# EAGLE design untitled (EAGLE 9.6.2)
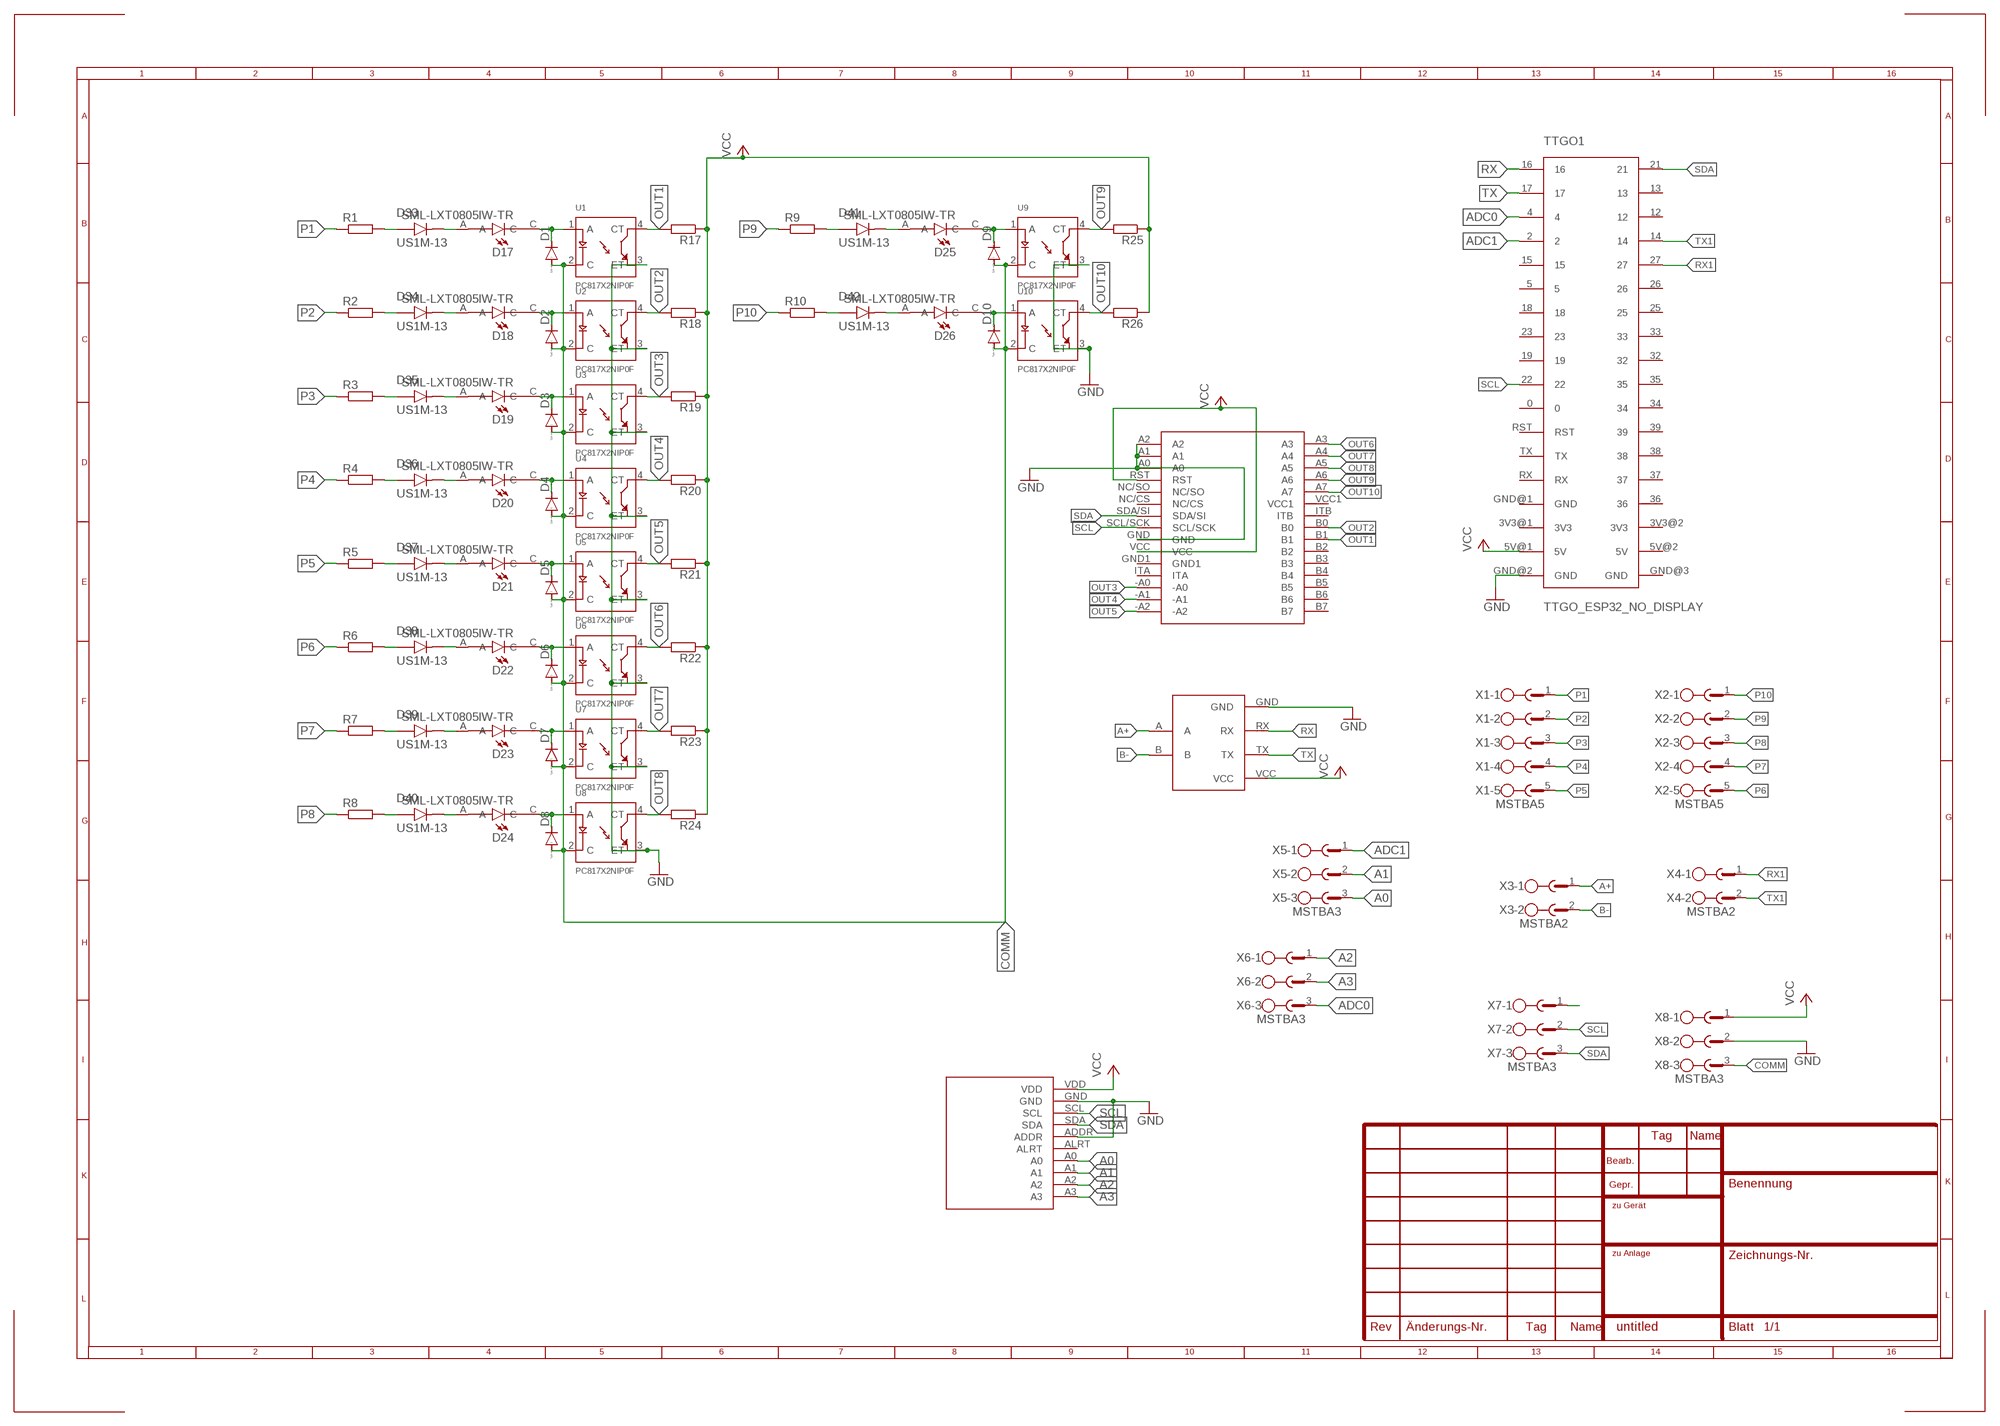
[diagram p0: schematic, sheet 1]

## Parts
ADS1  ADS1115  [ADS1115]
D1  DIODE-SOD123  [SOD123]
D2  DIODE-SOD123  [SOD123]
D3  DIODE-SOD123  [SOD123]
D4  DIODE-SOD123  [SOD123]
D5  DIODE-SOD123  [SOD123]
D6  DIODE-SOD123  [SOD123]
D7  DIODE-SOD123  [SOD123]
D8  DIODE-SOD123  [SOD123]
D9  DIODE-SOD123  [SOD123]
D10  DIODE-SOD123  [SOD123]
D17  SML-LXT0805IW-TR  [LEDC2012X120N]
D18  SML-LXT0805IW-TR  [LEDC2012X120N]
D19  SML-LXT0805IW-TR  [LEDC2012X120N]
D20  SML-LXT0805IW-TR  [LEDC2012X120N]
D21  SML-LXT0805IW-TR  [LEDC2012X120N]
D22  SML-LXT0805IW-TR  [LEDC2012X120N]
D23  SML-LXT0805IW-TR  [LEDC2012X120N]
D24  SML-LXT0805IW-TR  [LEDC2012X120N]
D25  SML-LXT0805IW-TR  [LEDC2012X120N]
D26  SML-LXT0805IW-TR  [LEDC2012X120N]
D33  US1M-13  [DIOM5226X240N]
D34  US1M-13  [DIOM5226X240N]
D35  US1M-13  [DIOM5226X240N]
D36  US1M-13  [DIOM5226X240N]
D37  US1M-13  [DIOM5226X240N]
D38  US1M-13  [DIOM5226X240N]
D39  US1M-13  [DIOM5226X240N]
D40  US1M-13  [DIOM5226X240N]
D41  US1M-13  [DIOM5226X240N]
D42  US1M-13  [DIOM5226X240N]
MCP1  MCP23017  [MCP23017]
R1  R-EU_0414/15  [0414/15]
R2  R-EU_0414/15  [0414/15]
R3  R-EU_0414/15  [0414/15]
R4  R-EU_0414/15  [0414/15]
R5  R-EU_0414/15  [0414/15]
R6  R-EU_0414/15  [0414/15]
R7  R-EU_0414/15  [0414/15]
R8  R-EU_0414/15  [0414/15]
R9  R-EU_0414/15  [0414/15]
R10  R-EU_0414/15  [0414/15]
R17  R-EU_R0805  [R0805]
R18  R-EU_R0805  [R0805]
R19  R-EU_R0805  [R0805]
R20  R-EU_R0805  [R0805]
R21  R-EU_R0805  [R0805]
R22  R-EU_R0805  [R0805]
R23  R-EU_R0805  [R0805]
R24  R-EU_R0805  [R0805]
R25  R-EU_R0805  [R0805]
R26  R-EU_R0805  [R0805]
TTGO1  TTGO_ESP32_NO_DISPLAY  [TTGO_ESP32_NO_DISPLAY]
TTL-RS1  TTL-RS485  [TTL-RS485]
U1  PC817X2NIP0F  [SOT254P975X400-4N]
U2  PC817X2NIP0F  [SOT254P975X400-4N]
U3  PC817X2NIP0F  [SOT254P975X400-4N]
U4  PC817X2NIP0F  [SOT254P975X400-4N]
U5  PC817X2NIP0F  [SOT254P975X400-4N]
U6  PC817X2NIP0F  [SOT254P975X400-4N]
U7  PC817X2NIP0F  [SOT254P975X400-4N]
U8  PC817X2NIP0F  [SOT254P975X400-4N]
U9  PC817X2NIP0F  [SOT254P975X400-4N]
U10  PC817X2NIP0F  [SOT254P975X400-4N]
X1  MSTBA5  [MSTBA5]
X2  MSTBA5  [MSTBA5]
X3  MSTBA2  [MSTBA2]
X4  MSTBA2  [MSTBA2]
X5  MSTBA3  [MSTBA3]
X6  MSTBA3  [MSTBA3]
X7  MSTBA3  [MSTBA3]
X8  MSTBA3  [MSTBA3]

## Nets
A0: ADS1.A0 X5.3
A1: ADS1.A1 X5.2
A2: ADS1.A2 X6.1
A3: ADS1.A3 X6.2
A+: TTL-RS1.A X3.1
ADC0: TTGO1.4 X6.3
ADC1: TTGO1.2 X5.1
B-: TTL-RS1.B X3.2
COMM: D1.A D2.A D3.A D4.A D5.A D6.A D7.A D8.A D9.A D10.A U1.2(C) U2.2(C) U3.2(C) U4.2(C) U5.2(C) U6.2(C) U7.2(C) U8.2(C) U9.2(C) U10.2(C) X8.3
GND: ADS1.ADDR ADS1.GND MCP1.A0 MCP1.A1 MCP1.A2 MCP1.GND TTGO1.GND@2(GND) TTL-RS1.GND U1.3(ET) U2.3(ET) U3.3(ET) U4.3(ET) U5.3(ET) U6.3(ET) U7.3(ET) U8.3(ET) U9.3(ET) U10.3(ET) X8.2
N$1: D17.A D33.C(K)
N$2: D33.A R1.2
N$3: D1.C D17.C U1.1(A)
N$5: D34.A R2.2
N$6: D18.A D34.C(K)
N$7: D2.C D18.C U2.1(A)
N$8: D35.A R3.2
N$9: D19.A D35.C(K)
N$10: D3.C D19.C U3.1(A)
N$11: D36.A R4.2
N$12: D20.A D36.C(K)
N$13: D4.C D20.C U4.1(A)
N$15: X7.1
N$17: D37.A R5.2
N$18: D21.A D37.C(K)
N$19: D5.C D21.C U5.1(A)
N$20: D38.A R6.2
N$21: D22.A D38.C(K)
N$22: D6.C D22.C U6.1(A)
N$25: D39.A R7.2
N$26: D23.A D39.C(K)
N$27: D7.C D23.C U7.1(A)
N$28: D40.A R8.2
N$29: D24.A D40.C(K)
N$30: D8.C D24.C U8.1(A)
N$33: D41.A R9.2
N$34: D25.A D41.C(K)
N$35: D9.C D25.C U9.1(A)
N$36: D42.A R10.2
N$37: D26.A D42.C(K)
N$38: D10.C D26.C U10.1(A)
OUT1: MCP1.B1 R17.2 U1.4(CT)
OUT2: MCP1.B0 R18.2 U2.4(CT)
OUT3: MCP1.-A0 R19.2 U3.4(CT)
OUT4: MCP1.-A1 R20.2 U4.4(CT)
OUT5: MCP1.-A2 R21.2 U5.4(CT)
OUT6: MCP1.A3 R22.2 U6.4(CT)
OUT7: MCP1.A4 R23.2 U7.4(CT)
OUT8: MCP1.A5 R24.2 U8.4(CT)
OUT9: MCP1.A6 R25.2 U9.4(CT)
OUT10: MCP1.A7 R26.2 U10.4(CT)
P1: R1.1 X1.1
P2: R2.1 X1.2
P3: R3.1 X1.3
P4: R4.1 X1.4
P5: R5.1 X1.5
P6: R6.1 X2.5
P7: R7.1 X2.4
P8: R8.1 X2.3
P9: R9.1 X2.2
P10: R10.1 X2.1
RX: TTGO1.16 TTL-RS1.RX
RX1: TTGO1.27 X4.1
SCL: ADS1.SCL MCP1.SCL/SCK TTGO1.22 X7.2
SDA: ADS1.SDA MCP1.SDA/SI TTGO1.21 X7.3
TX: TTGO1.17 TTL-RS1.TX
TX1: TTGO1.14 X4.2
VCC: ADS1.VDD MCP1.RST MCP1.VCC R17.1 R18.1 R19.1 R20.1 R21.1 R22.1 R23.1 R24.1 R25.1 R26.1 TTGO1.5V@1(5V) TTL-RS1.VCC X8.1
Unconnected: ADS1.ALRT MCP1.B2 MCP1.B3 MCP1.B4 MCP1.B5 MCP1.B6 MCP1.B7 MCP1.GND1 MCP1.ITA MCP1.ITB MCP1.NC/CS MCP1.NC/SO MCP1.VCC1 TTGO1.0 TTGO1.3V3@1(3V3) TTGO1.3V3@2(3V3) TTGO1.5 TTGO1.5V@2(5V) TTGO1.12 TTGO1.13 TTGO1.15 TTGO1.18 TTGO1.19 TTGO1.23 TTGO1.25 TTGO1.26 TTGO1.32 TTGO1.33 TTGO1.34 TTGO1.35 TTGO1.36 TTGO1.37 TTGO1.38 TTGO1.39 TTGO1.GND@1(GND) TTGO1.GND@3(GND) TTGO1.RST TTGO1.RX TTGO1.TX

## Library data of the parts
ADS1 = ds1115:ADS1115
D1-D10 = diode:DIODE-: DIODE
D17-D26 = SML-LXT0805IW-TR:SML-LXT0805IW-TR: LED; Luminous Intensity:11µcd; Viewing Angle:140°; Forward Current:30mA; Forward Voltage:2V; Color:Red; LED Color:Red; Leaded Process Compatible:Yes; Lens Color:White; Mounting Type:Surface Mount ;RoHS Compliant: Yes Check availability <https://pricing.snapeda.com/parts/SML-LXT0805IW-TR/Lumex%20Opto/Components/view-part?ref=eda>; AVAILABILITY: In Stock; DESCRIPTION: Red - LED Indication - Discrete 2V 0805 (2012 Metric); MF: Lumex Opto/Components; MP: SML-LXT0805IW-TR; PACKAGE: 0805 Lumex; PRICE: None; PURCHASE-URL: https://pricing.snapeda.com/search/part/SML-LXT0805IW-TR/?ref=eda
D33-D42 = US1M-13:US1M-13: Diode, Fast Recovery, 1a, 1kv, Do-214ac-2, Full Reel Check availability <https://pricing.snapeda.com/parts/US1M-13/Diodes%20Incorporated/view-part?ref=eda>; AVAILABILITY: In Stock; DESCRIPTION: Diode Standard 1000 V 1A Surface Mount SMA; MF: Diodes Incorporated; MP: US1M-13; PACKAGE: DO-214AC-214 Diodes Incorporated; PRICE: None; PURCHASE-URL: https://pricing.snapeda.com/search/part/US1M-13/?ref=eda
MCP1 = mcp23017:MCP23017
R1-R10 R17-R26 = rcl:R-EU_: RESISTOR, European symbol; SPICEPREFIX: R
TTGO1 = TTGO_32_without_display:TTGO_ESP32_NO_DISPLAY
TTL-RS1 = TTL-RS485:TTL-RS485
U1-U10 = PC817X2NIP0F:PC817X2NIP0F: PC817 Series 1 Channel 80 V 5000 Vrms General Purpose Photocoupler - DIP-4 Check availability <https://pricing.snapeda.com/parts/PC817X2NIP0F/Sharp%20Microelectronics/view-part?ref=eda>; AVAILABILITY: Not in stock; DESCRIPTION: Optoisolator Transistor Output 5000Vrms 1 Channel 4-SMD; MF: Sharp Microelectronics; MP: PC817X2NIP0F; PACKAGE: SMD-4 Sharp Microelectronics; PRICE: None
X1 X2 = con-phoenix-508:MSTBA5: PHOENIX; MPN: 1757271; OC_FARNELL: 3705201; OC_NEWARK: 71C4164
X3 X4 = con-phoenix-508:MSTBA2: PHOENIX; MF: FARNELL; MPN: 1757242; OC_FARNELL: 3705171; OC_NEWARK: 71C4161
X5-X8 = con-phoenix-508:MSTBA3: PHOENIX; MF: FARNELL; MPN: 1757255; OC_FARNELL: 3705183; OC_NEWARK: 71C4162

## Board
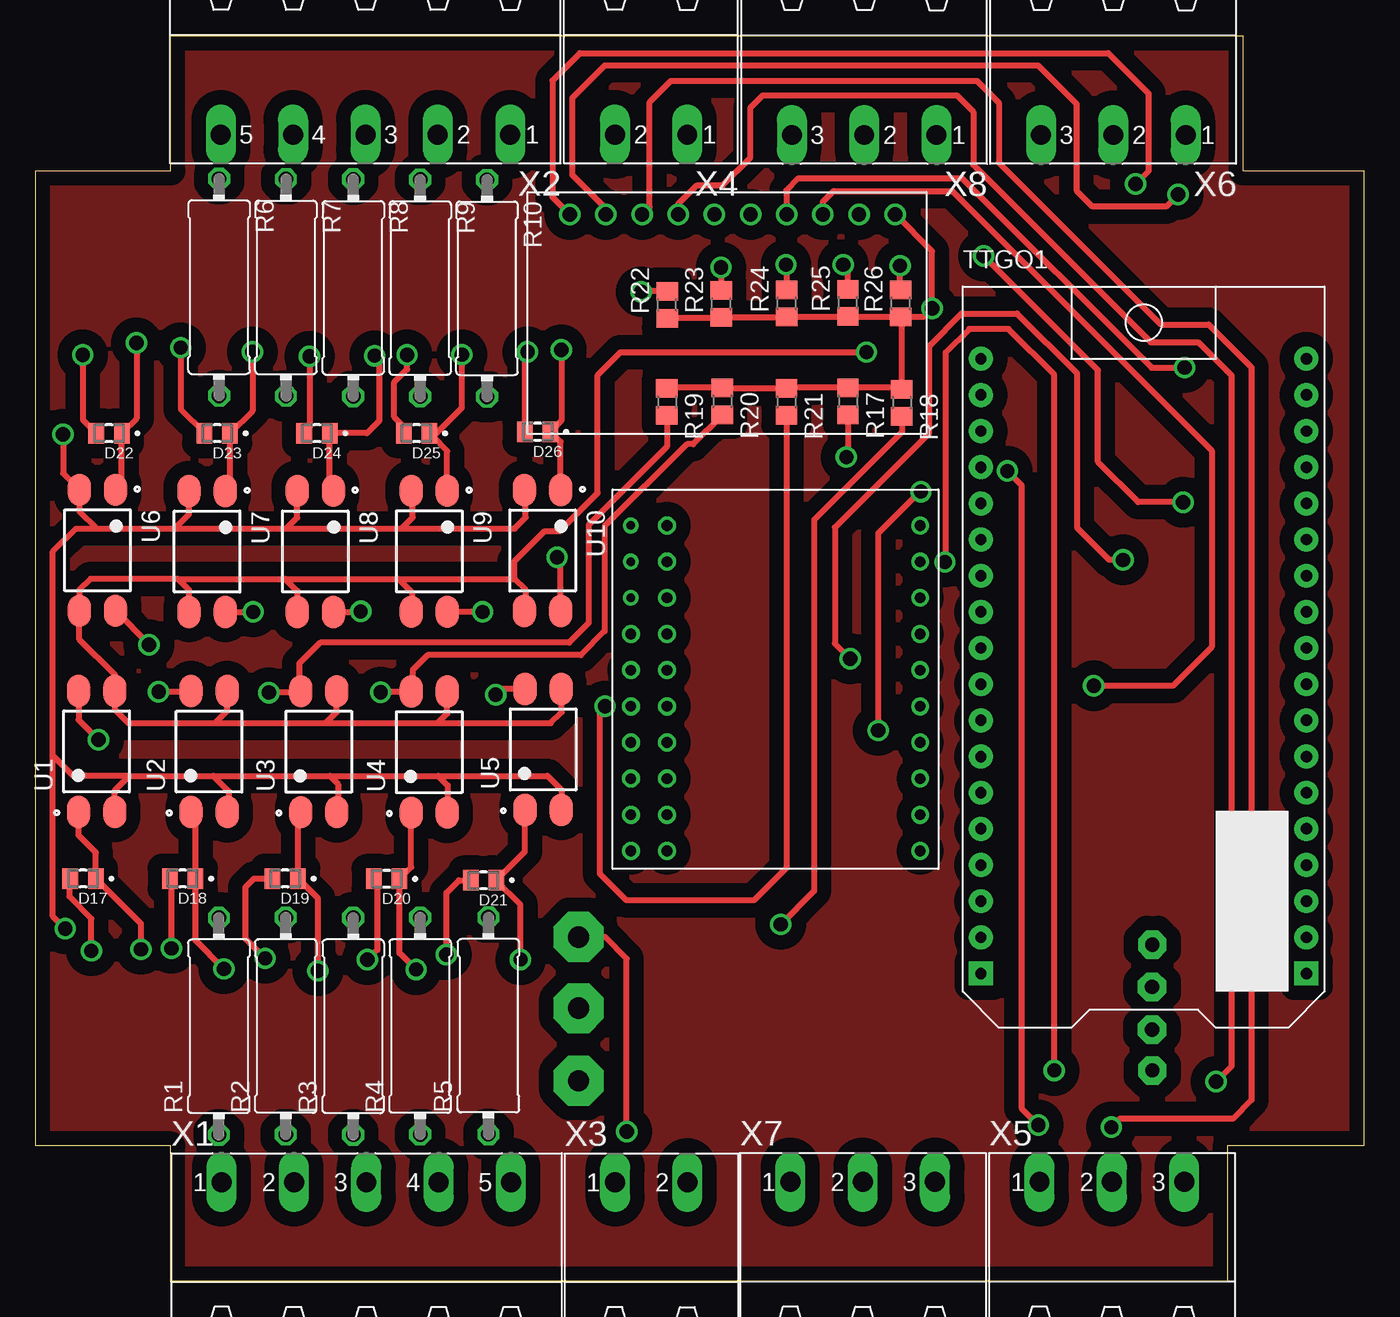
[diagram p1: board, top side]
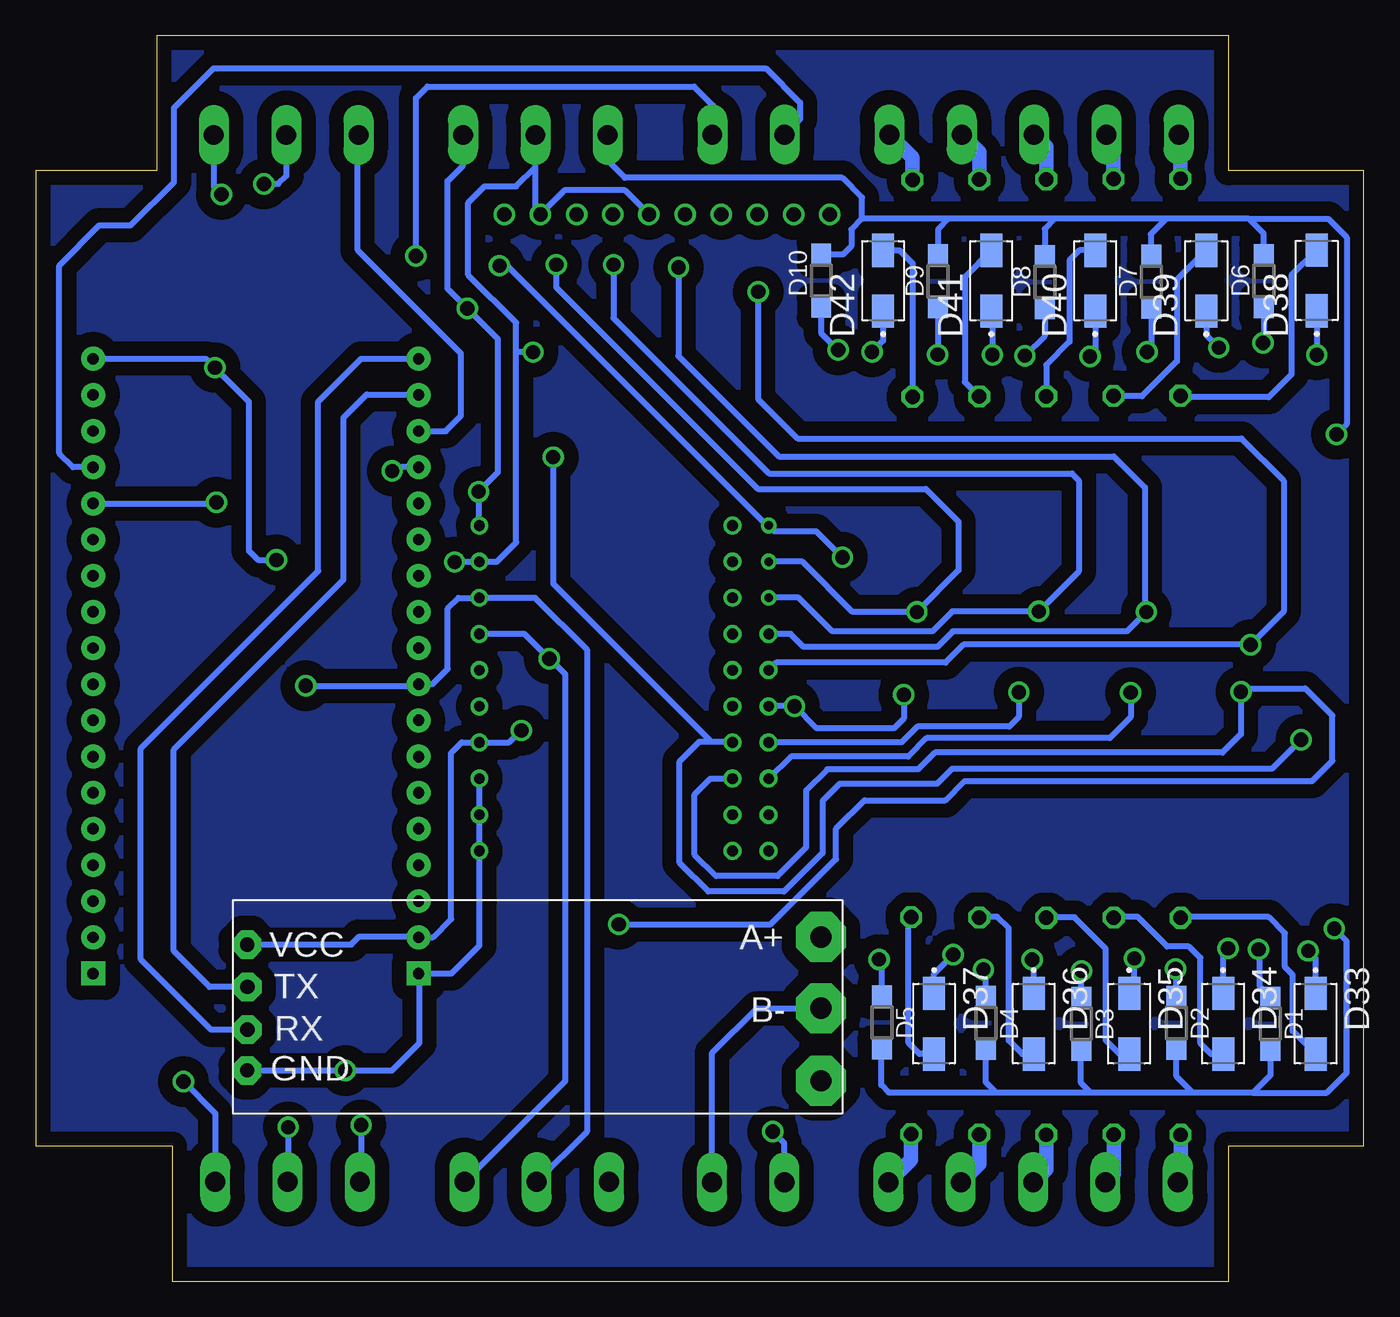
[diagram p2: board, bottom side, seen from below]

Size 93.3 x 87.5 mm. Coordinates in mm from the lower left corner, seen from the top.
Outline: 9.5,87.5 84.8,87.5 84.8,78 93.3,78 93.3,9.5 83.7,9.5 83.7,0 9.5,0 9.5,9.5 0,9.5 0,78 9.5,78 9.5,87.5
Copper layers (1*16): Top 0.035mm / dielectric 1.5mm / Bottom 0.035mm
Design rules "default": minimum track width 6mil, minimum drill 0.35mm, track to track 6mil, track to pad 6mil, pad to pad 6mil, via to via 6mil, smd to smd 6mil, copper to edge 40mil, drill to drill 6mil, minimum pad ring 10mil, minimum via ring 8mil, stop-mask expansion 4mil, vias tented up to drill 0mil, thermal gap 10mil

### Footprints (pad centres in the part's own frame; a part is rotated, then mirrored left to right if it is on the bottom)
ADS1115 = drill 1: A0 -6.35,-1.27; A1 -6.35,-3.81; A2 -6.35,-6.35; A3 -6.35,-8.89; ADDR -6.35,3.81; ALRT -6.35,1.27; GND -6.35,11.43; SCL -6.35,8.89; SDA -6.35,6.35; VDD -6.35,13.97
SOD123 = smd 1.4 x 1.4: A 1.9,0; C -1.9,0
LEDC2012X120N = smd 1.1 x 1.45: A 0.9,0; C -0.9,0
DIOM5226X240N = smd 2.33 x 1.55: A 2.135,0; C -2.135,0
MCP23017 = drill 0.75: -A0 11.43,6.35; -A1 11.43,3.81; -A2 11.43,1.27; A0 -8.89,6.35; A1 -8.89,8.89; A2 -8.89,11.43; A3 11.43,-1.27; A4 11.43,-3.81; B0 8.89,6.35; B1 8.89,3.81; B2 8.89,1.27; B3 8.89,-1.27; B4 8.89,-3.81; B5 8.89,-6.35; B6 8.89,-8.89; B7 8.89,-11.43; GND -8.89,-8.89; GND1 11.43,11.43; ITA 11.43,8.89; ITB 8.89,8.89; NC/CS -8.89,-1.27; NC/SO -8.89,1.27; RST -8.89,3.81; SCL/SCK -8.89,-6.35; SDA/SI -8.89,-3.81; VCC -8.89,-11.43; VCC1 8.89,11.43 | drill 0.6: A5 11.43,-6.35; A6 11.43,-8.89; A7 11.43,-11.43
0414/15 = drill 1.016 octagon: 1 -7.62,0; 2 7.62,0
R0805 = smd 1.3 x 1.5: 1 -0.95,0; 2 0.95,0
TTGO_ESP32_NO_DISPLAY = drill 0.8 pad 1.676: 0 1.27,-30.48; 2 1.27,-12.7; 3V3@1 1.27,-43.18; 3V3@2 24.13,-43.18; 4 1.27,-10.16; 5 1.27,-17.78; 5V@1 1.27,-45.72; 5V@2 24.13,-45.72; 12 24.13,-10.16; 13 24.13,-7.62; 14 24.13,-12.7; 15 1.27,-15.24; 16 1.27,-5.08; 17 1.27,-7.62; 18 1.27,-20.32; 19 1.27,-25.4; 21 24.13,-5.08; 22 1.27,-27.94; 23 1.27,-22.86; 25 24.13,-20.32; 26 24.13,-17.78; 27 24.13,-15.24; 32 24.13,-25.4; 33 24.13,-22.86; 34 24.13,-30.48; 35 24.13,-27.94; 36 24.13,-40.64; 37 24.13,-38.1; 38 24.13,-35.56; 39 24.13,-33.02; GND@1 1.27,-40.64; RST 1.27,-33.02; RX 1.27,-38.1; TX 1.27,-35.56 | drill 0.8 pad 1.676 square: GND@2 1.27,-48.26; GND@3 24.13,-48.26
TTL-RS485 = drill 1.5 pad 3.5 octagon: A -19.7,-6; B -19.7,-1; P$7 -19.7,4.1 | drill 1 pad 2 octagon: GND 20.6,3.37; RX 20.581,0.505; TX 20.583,-2.493; VCC 20.6,-5.47
SOT254P975X400-4N = smd 2.25 x 1.6: 1 -4.25,1.27; 2 -4.25,-1.27; 3 4.25,-1.27; 4 4.25,1.27
MSTBA5 = drill 1.397 long: 1 -10.16,5.08; 2 -5.08,5.08; 3 0,5.08; 4 5.08,5.08; 5 10.16,5.08
MSTBA2 = drill 1.397 long: 1 -2.54,5.08; 2 2.54,5.08
MSTBA3 = drill 1.397 long: 1 -5.08,5.08; 2 0,5.08; 3 5.08,5.08

### Placement (x,y rotation side)
ADS1  46.41,68.59 270 top
D1  6.56,18.09 270 bottom
D2  13.16,18.14 270 bottom
D3  19.86,18.09 270 bottom
D4  26.56,18.14 270 bottom
D5  33.86,18.19 270 bottom
D6  7.04,70.26 90 bottom
D7  14.94,70.21 90 bottom
D8  22.42,70.19 90 bottom
D9  29.92,70.24 90 bottom
D10  38.12,70.29 90 bottom
D17  3.33,28.29 180 top
D18  10.33,28.29 180 top
D19  17.53,28.29 180 top
D20  24.66,28.27 180 top
D21  31.46,28.17 180 top
D22  5.16,59.57 180 top
D23  12.76,59.57 180 top
D24  19.76,59.57 180 top
D25  26.76,59.57 180 top
D26  35.26,59.67 180 top
D33  3.39,18.1 270 bottom
D34  9.89,18.1 270 bottom
D35  16.49,18.1 270 bottom
D36  23.19,18.1 270 bottom
D37  30.19,18.1 270 bottom
D38  3.31,70.3 90 bottom
D39  11.07,70.28 90 bottom
D40  18.87,70.28 90 bottom
D41  26.17,70.28 90 bottom
D42  33.77,70.28 90 bottom
MCP1  53.24,41.66 180 top
R1  12.87,17.91 90 top
R2  17.57,17.93 90 top
R3  22.31,17.91 90 top
R4  27.01,17.93 90 top
R5  31.81,17.95 90 top
R6  12.89,69.83 270 top
R7  17.59,69.81 270 top
R8  22.31,69.79 270 top
R9  27.01,69.77 270 top
R10  31.71,69.75 270 top
R17  57.06,61.81 270 top
R18  60.84,61.71 270 top
R19  44.34,61.76 270 top
R20  48.24,61.81 270 top
R21  52.74,61.76 270 top
R22  44.36,68.59 90 top
R23  48.16,68.64 90 top
R24  52.76,68.69 90 top
R25  57.06,68.74 90 top
R26  60.76,68.69 90 top
TTGO1  65.13,69.88 0 top
TTL-RS1  57.84,18.18 180 bottom
U1  4.29,37.22 90 top
U2  12.19,37.21 90 top
U3  19.89,37.2 90 top
U4  27.65,37.17 90 top
U5  35.65,37.36 90 top
U6  4.35,51.35 270 top
U7  12.05,51.26 270 top
U8  19.65,51.27 270 top
U9  27.65,51.28 270 top
U10  35.61,51.33 270 top
X1  23.23,1.88 0 top
X2  23.17,85.63 180 top
X3  43.24,1.87 0 top
X4  43.23,85.63 180 top
X5  75.6,1.9 0 top
X6  75.7,85.6 180 top
X7  58.1,1.9 0 top
X8  58.2,85.6 180 top

### Tracks (layer width: path | path; a pad name or v marks a point on that pad's centre or on a via)
A0  (via drill 1)
  Top 0.406: ADS1.A0 45.14,75.65 46.47,76.98 48.25,76.98 50.2,78.93 50.2,82.43 51.09,83.31 64.7,83.31 65.87,82.14 65.87,78.42 78.32,65.97 81.67,65.97 83.99,63.64 83.99,15.11 v82.91,14.03
  Bottom 0.406: v82.91,14.03 80.68,11.8 X5.3
A1  (via drill 1)
  Top 0.406: ADS1.A1 43.12,75.47 43.12,82.83 44.62,84.33 66.12,84.33 67.66,82.8 67.66,78.59 79.04,67.21 82.4,67.21 85.4,64.21 85.4,12.71 84.12,11.43 76.16,11.43 v75.56,10.82
  Bottom 0.406: v75.56,10.82 75.56,7.02 X5.2
A2  (via drill 1)
  Top 0.406: ADS1.A2 40.06,75.34 37.7,77.7 37.7,83.13 39.99,85.41 70.41,85.41 73.12,82.7 73.12,76.61 74.23,75.5 79.41,75.5 v80.25,76.34
  Bottom 0.406: X6.1 80.78,76.87 v80.25,76.34
A3  (via drill 1)
  Top 0.406: ADS1.A3 36.31,76.15 36.31,84.33 38.24,86.27 75.34,86.27 78.17,83.44 78.17,77.99 v77.26,77.08
  Bottom 0.406: v77.26,77.08 76.25,77.08 75.68,77.65 75.68,80.5 X6.2
A+  (via drill 1)
  Top 0.406: v41.52,10.51 41.52,22.66 40,24.18 TTL-RS1.A
  Bottom 0.406: X3.1 40.7,9.69 v41.52,10.51
ADC0
  Bottom 0.406: TTGO1.4 64.49,59.72 63.41,60.8 63.41,65.17 70.68,72.43 70.68,80.46 X6.3
ADC1  (via drill 1)
  Top 0.406: v68.26,56.92 69.25,55.93 69.25,12.16 v70.44,10.97
  Bottom 0.406: TTGO1.2 67.99,57.18 v68.26,56.92 | v70.44,10.97 70.44,7.06 X5.1
B-
  Bottom 0.406: X3.2 45.78,16.05 42.65,19.18 TTL-RS1.B
COMM  (via drill 1)
  Top 0.406: 4.29,52.87 3.08,54.08 U6.2 1.93,56.76 v1.93,59.49 | 4.29,52.87 9.76,52.87 | U7.2 10.78,53.89 9.76,52.87 | 9.76,52.87 17.61,52.87 | U8.2 18.38,53.64 17.61,52.87 | 17.61,52.87 25.72,52.87 | 25.72,52.87 26.5,53.65 26.5,55.41 U9.2 | 25.72,52.87 33.65,52.87 34.42,53.65 34.42,55.5 U10.2 | U1.2 5.56,34.48 6.58,35.5 | 6.58,35.5 12.48,35.5 | 12.48,35.5 13.56,34.42 13.56,33.06 U2.2 | 12.48,35.5 20.68,35.5 | 20.68,35.5 21.25,34.93 21.25,33.03 U3.2 | 20.68,35.5 28.29,35.5 | 28.29,35.5 28.95,34.83 28.95,32.95 U4.2 | 28.29,35.5 35.96,35.5 36.94,34.52 36.94,33.13 U5.2 | 6.58,35.5 2.65,35.5 1.22,36.93 | 1.22,36.93 1.22,51.24 2.85,52.87 4.29,52.87 | v2.08,24.77 1.22,25.63 1.22,36.93
  Bottom 0.406: D1.A 6.56,14.47 7.79,13.24 | 7.79,13.24 12,13.24 | 12,13.24 13.17,14.41 13.17,16.23 D2.A | 12,13.24 19.18,13.24 | 19.18,13.24 19.88,13.94 19.88,16.17 D3.A | 19.18,13.24 25.82,13.24 | 25.82,13.24 26.57,13.99 D4.A | 25.82,13.24 33.36,13.24 33.9,13.78 33.9,16.25 D5.A | D6.A 7.04,73.6 8.07,74.63 | 8.07,74.63 13.88,74.63 | 13.88,74.63 14.97,73.54 14.97,72.14 D7.A | 13.88,74.63 21.7,74.63 | D8.A 22.42,73.91 21.7,74.63 | 21.7,74.63 29.17,74.63 | D9.A 29.92,73.87 29.17,74.63 | 8.07,74.63 2.51,74.63 1.22,73.34 1.22,60.2 v1.93,59.49 | 7.79,13.24 2.6,13.24 1.22,14.62 1.22,23.91 v2.08,24.77 | 29.17,74.63 35.25,74.63 | 35.25,74.63 36,73.88 36,72.7 36.59,72.11 38.04,72.11 D10.A | 35.25,74.63 35.25,76.13 36.64,77.52 51.9,77.52 53.16,78.78 53.16,80.47 X8.3
GND  (via drill 1)
  Top 0.406: U7.3 10.78,48.56 10.01,49.33 | 10.01,49.33 3.84,49.33 3.08,48.57 U6.3 3.08,45.1 5.56,42.62 U1.3 5.56,40.16 6.52,39.2 12.6,39.2 | 10.01,49.33 17.54,49.33 | U8.3 18.38,48.49 17.54,49.33 | 17.54,49.33 25.49,49.33 | 25.49,49.33 26.45,48.38 26.45,47.09 U9.3 | 25.49,49.33 33.65,49.33 | 33.65,49.33 34.4,48.58 34.4,47.14 U10.3 | U2.3 13.46,40.07 12.6,39.2 | 12.6,39.2 20.38,39.2 | U3.3 21.16,39.98 20.38,39.2 | 20.38,39.2 28.24,39.2 | U4.3 28.92,39.88 28.24,39.2 | 28.24,39.2 36.18,39.2 36.95,39.97 36.95,41.58 U5.3 | v71.55,14.81 71.55,63.68 68.33,66.89 65.58,66.89 63.92,65.23 63.92,50.58 63.86,50.52 v63.87,50.52 | 33.65,49.33 33.65,50.59 35.75,52.69 36.8,52.69 39.47,55.37 39.47,63.67 41.07,65.26 v58.35,65.26
  Bottom 0.406: TTL-RS1.GND v71.55,14.81 68.26,14.81 66.34,16.73 66.34,21.56 TTGO1.GND@2 64.09,21.62 62.13,23.58 MCP1.A2 MCP1.A1 MCP1.A0 | 59.55,65.25 59.55,51.9 60.89,50.55 MCP1.GND 63.84,50.55 v63.87,50.52 | 59.55,65.25 59.55,67.33 62.91,70.69 62.91,75.76 61.77,76.91 59.55,76.91 58.2,78.26 | v58.35,65.26 58.36,65.25 59.55,65.25 | 58.2,78.26 X8.2 | 58.2,78.26 58.2,75.3 ADS1.GND 56.16,76.63 51.9,76.63 ADS1.ADDR
N$1  (via drill 1)
  Top 0.406: v3.91,23.21 3.91,25.47 2.38,27 2.38,28.24 D17.A
  Bottom 0.406: D33.C 3.39,22.69 v3.91,23.21
N$2
  Bottom 0.406: D33.A 5.01,17.58 5.01,21.54 5.54,22.07 5.54,24.44 6.69,25.59 12.81,25.59 R1.2
N$3  (via drill 1)
  Top 0.406: U1.1 3.02,31.33 4.23,30.12 D17.C 7.4,25.12 v7.4,23.31
  Bottom 0.406: D1.C 7.34,20.77 7.34,23.31 v7.4,23.31
N$4
  pour Bottom (isolate 1.016): 0,78 9.5,78 9.5,87.5 84.9,87.5 84.9,78 93.3,78 93.3,9.5 83.7,9.5 83.7,0 9.5,0 9.5,9.5 0,9.5
N$5
  Bottom 0.406: D34.A 10.74,15.96 11.48,16.71 11.48,22.72 12.28,23.52 13.81,23.52 15.89,25.6 17.52,25.6 R2.2
N$6  (via drill 1)
  Top 0.406: D18.A 9.53,28.19 v9.53,23.39
  Bottom 0.406: D34.C 9.89,23.03 v9.53,23.39
N$7  (via drill 1)
  Top 0.406: U2.1 11.23,32.65 D18.C 11.23,23.94 v13.23,21.94
  Bottom 0.406: D2.C 13.16,21.87 v13.23,21.94
N$8
  Bottom 0.406: D35.A 17.16,15.96 18.14,16.94 18.14,23.37 20.33,25.56 22.28,25.56 R3.2
N$9  (via drill 1)
  Top 0.406: v16.12,22.68 14.72,24.08 14.72,27.68 15.34,28.29 D19.A
  Bottom 0.406: D35.C 16.12,20.6 v16.12,22.68
N$10  (via drill 1)
  Top 0.406: U3.1 18.43,32.76 D19.C 19.83,26.89 v19.83,21.8
  Bottom 0.406: D3.C 19.86,21.77 v19.83,21.8
N$11
  Bottom 0.406: D36.A 24,15.96 24.95,16.92 24.95,24.81 25.75,25.61 26.95,25.61 R4.2
N$12  (via drill 1)
  Top 0.406: D20.A 23.99,28.04 23.99,23.27 v23.31,22.59
  Bottom 0.406: D36.C 23.19,22.47 v23.31,22.59
N$13  (via drill 1)
  Top 0.406: U4.1 26.38,29.09 D20.C 25.56,23.07 v26.73,21.9
  Bottom 0.406: D4.C 26.56,21.74 v26.73,21.9
N$14
  pour Top (isolate 1.016): 0,78 9.5,78 9.5,87.5 84.9,87.5 84.9,78 93.3,78 93.3,9.5 83.7,9.5 83.7,0 9.5,0 9.5,9.5 0,9.5
N$17
  Bottom 0.406: D37.A 31.21,15.96 31.99,16.75 31.99,25.39 R5.2
N$18  (via drill 1)
  Top 0.406: v28.85,22.94 28.85,27.29 29.74,28.17 D21.A
  Bottom 0.406: D37.C 30.19,21.6 v28.85,22.94
N$19  (via drill 1)
  Top 0.406: U5.1 34.38,30.19 D21.C 34.06,26.47 v34.06,22.6
  Bottom 0.406: D5.C 33.86,22.4 v34.06,22.6
N$20
  Bottom 0.406: D38.A 5.09,70.66 5.09,63.7 6.68,62.1 12.78,62.1 R6.2
N$21  (via drill 1)
  Top 0.406: v3.31,65.08 3.31,60.52 D22.A
  Bottom 0.406: D38.C v3.31,65.08
N$22  (via drill 1)
  Top 0.406: U6.1 6.06,56.04 D22.C 7.09,60.6 v7.09,65.91
  Bottom 0.406: D6.C 7.04,65.93 7.08,65.89 v7.09,65.91
N$25
  Bottom 0.406: D39.A 13.13,70.36 13.13,64.63 15.6,62.16 17.56,62.16 R7.2
N$26  (via drill 1)
  Top 0.406: v10.19,65.58 10.19,61.24 D23.A
  Bottom 0.406: D39.C 11.07,66.46 v10.19,65.58
N$27  (via drill 1)
  Top 0.406: U7.1 13.66,55.85 D23.C 15.23,61.14 v15.23,65.29
  Bottom 0.406: D7.C 14.94,65.58 v15.23,65.29
N$28
  Bottom 0.406: D40.A 19.98,72.42 20.67,71.72 20.67,66 22.31,64.36 R8.2
N$29  (via drill 1)
  Top 0.406: v19.24,64.97 19.24,59.95 D24.A
  Bottom 0.406: D40.C 18.87,65.34 v19.24,64.97
N$30  (via drill 1)
  Top 0.406: U8.1 20.66,55.78 D24.C | 20.4,59.83 D24.C | v23.81,65.02 24.14,64.69 24.14,60.44 23.27,59.57 D24.C
  Bottom 0.406: D8.C 22.42,66.41 v23.81,65.02
N$33
  Bottom 0.406: D41.A 28.04,70.55 28.04,63.18 R9.2
N$34  (via drill 1)
  Top 0.406: D25.A 26.09,59.8 25.2,60.7 25.2,63.16 26.09,64.06 v26.09,65.07
  Bottom 0.406: D41.C 26.09,68.07 v26.09,65.07
N$35  (via drill 1)
  Top 0.406: U9.1 28.92,58.31 27.91,59.32 | 27.91,59.32 D25.C | v29.93,65.09 29.93,61.35 27.91,59.32
  Bottom 0.406: D9.C v29.92,65.1 v29.93,65.09
N$36
  Bottom 0.406: D42.A 32.61,72.42 31.69,71.49 31.71,71.47 R10.2
N$37  (via drill 1)
  Top 0.406: v34.55,65.29 34.36,65.1 D26.A
  Bottom 0.406: D42.C 33.77,66.07 v34.55,65.29
N$38  (via drill 1)
  Top 0.406: U10.1 36.88,58.95 D26.C 36.93,60.44 v36.93,65.42
  Bottom 0.406: D10.C 38.12,66.61 v36.93,65.42
OUT1  (via drill 1)
  Top 0.406: U1.4 3.02,39.44 v4.42,38.04 | R17.2 57.06,58.04 56.95,57.93 v56.95,57.89
  Bottom 0.406: MCP1.B1 44.38,37.82 44.47,37.92 45.87,37.92 | v4.42,38.04 6.47,35.99 28.94,35.99 29.99,34.94 36.83,34.94 38.03,33.73 38.03,30.09 40.74,27.38 46.04,27.38 48.06,29.39 48.06,36.53 46.67,37.92 45.87,37.92 | v56.95,57.89 56.95,49 45.87,37.92
OUT2  (via drill 1)
  Top 0.406: U2.4 10.87,41.41 v8.64,41.41 | R18.2 60.84,59.64 54.68,53.48 54.68,27.41 v52.34,25.07
  Bottom 0.406: MCP1.B0 45.91,35.31 47,34.21 47,29.97 45.5,28.46 41.19,28.46 39.17,30.48 39.17,34.48 37.7,35.96 31.32,35.96 30.14,37.13 9.94,37.13 8.64,38.43 v8.64,41.41 8.41,41.64 4.12,41.64 2.21,39.73 2.21,36.57 3.64,35.13 28.06,35.13 29.4,33.79 35.08,33.79 37.08,31.8 37.08,29.67 41.67,25.07 v52.34,25.07
OUT3  (via drill 1)
  Top 0.406: U3.4 18.52,41.35 | 18.52,41.35 v16.38,41.35 | R19.2 44.34,58.63 38.85,53.13 38.85,46.24 37.48,44.87 19.99,44.87 18.52,43.4 18.52,41.35
  Bottom 0.406: v16.38,41.35 16.38,39.63 17.86,38.16 30.71,38.16 32.01,36.86 40.26,36.86 MCP1.-A0
OUT4  (via drill 1)
  Top 0.406: v24.24,41.38 26.34,41.38 U4.4 26.38,40.72 26.48,40.62 26.48,42.93 27.54,43.99 38.3,43.99 39.98,45.67 39.98,53.03 45.74,58.8 46.18,58.8 R20.2
  Bottom 0.406: v24.24,41.38 24.24,39.65 24.91,38.97 31.36,38.97 32.48,37.85 MCP1.-A1
OUT5  (via drill 1)
  Top 0.406: U5.4 32.72,41.61 v32.32,41.2 | R21.2 52.74,29.03 50.48,26.76 41.5,26.76 39.63,28.63 39.63,40.16 39.93,40.46 v39.99,40.4
  Bottom 0.406: v32.32,41.2 32.32,39.55 33.02,38.84 38.44,38.84 v39.99,40.4 MCP1.-A2
OUT6  (via drill 1)
  Top 0.406: U6.4 7.95,44.77 v7.95,44.72 | R22.2 42.58,69.54 v42.55,69.51
  Bottom 0.406: MCP1.A3 41.28,43.46 29.38,43.46 28.13,44.72 v7.95,44.72 5.63,47.04 5.63,56.24 8.6,59.2 39.78,59.2 42.55,61.97 v42.55,69.51
OUT7  (via drill 1)
  Top 0.406: U7.4 15.03,47.01 15.03,47.02 v15.29,47.02 | R23.2 48.16,71.21 v48.15,71.23
  Bottom 0.406: v15.29,47.02 15.39,46.91 | 15.39,46.91 16.66,45.64 28.87,45.64 29.95,44.56 39.35,44.56 40.26,45.47 MCP1.A4 | 15.39,46.91 15.39,55.75 17.58,57.94 41.1,57.94 48.15,64.99 v48.15,71.23
OUT8  (via drill 1)
  Top 0.406: U8.4 22.58,47.02 22.62,46.98 22.76,46.98 v22.84,47.05 | R24.2 52.76,71.35 v52.71,71.41
  Bottom 0.406: MCP1.A5 41.79,48.03 39.71,48.03 37.33,45.64 30.32,45.64 28.91,47.05 v22.84,47.05 20.02,49.87 20.02,56.26 20.5,56.74 41.78,56.74 52.71,67.67 v52.71,71.41
OUT9  (via drill 1)
  Top 0.406: U9.4 31.39,47.03 v31.4,47.02 | R25.2 57.06,71.08 v56.73,71.41
  Bottom 0.406: MCP1.A6 39.45,50.55 35.92,47.02 v31.4,47.02 28.47,49.94 28.47,53.35 30.78,55.66 42.57,55.66 56.73,69.82 v56.73,71.41
OUT10  (via drill 1)
  Top 0.406: U10.4 36.88,50.6 v36.63,50.85 | R26.2 60.72,69.68 v60.72,71.34
  Bottom 0.406: v36.63,50.85 38.47,52.7 41.42,52.7 MCP1.A7 41.94,53.09 60.19,71.34 v60.72,71.34
P1
  Bottom 1.016: X1.1 12.87,7.16 R1.1
P2
  Bottom 1.016: X1.2 17.57,7.54 R2.1
P3
  Bottom 1.016: X1.3 22.31,7.88 R3.1
P4
  Bottom 1.016: X1.4 27.01,8.26 R4.1
P5
  Bottom 1.016: X1.5 31.81,8.54 R5.1
P6
  Bottom 1.016: X2.5 12.89,80.43 R6.1
P7
  Bottom 1.016: X2.4 17.59,80.05 R7.1
P8
  Bottom 1.016: X2.3 22.31,79.69 R8.1
P9
  Bottom 1.016: X2.2 27.01,79.31 R9.1
P10
  Bottom 1.016: X2.1 31.71,78.93 R10.1
RX
  Bottom 0.406: TTL-RS1.RX 80.97,17.68 85.9,22.6 85.9,37.44 73.44,49.9 73.44,61.81 70.45,64.8 TTGO1.16
RX1  (via drill 1)
  Top 0.406: v80.6,54.72 77.44,54.72 74.61,57.55 74.61,64 v66.58,72.03
  Bottom 0.406: TTGO1.27 80.6,54.64 v80.6,54.72 | v66.58,72.03 66.58,83.11 65.78,83.92 47.04,83.92 45.71,82.59 45.71,80.61 X4.1
SCL  (via drill 1)
  Top 0.406: ADS1.SCL 55.3,75.83 56.04,76.58 64.38,76.58 82.6,58.35 82.6,44.56 79.88,41.83 v74.33,41.83
  Bottom 0.406: X7.2 54.58,10.51 54.58,44.38 58.2,48.01 MCP1.SCL/SCK 63.6,48.01 64.36,47.26 64.36,43.01 65.43,41.94 TTGO1.22 66.51,41.83 v74.33,41.83
SDA  (via drill 1)
  Top 0.406: v57.23,43.73 56.14,44.82 56.14,52.95 62.76,59.57 62.76,65.7 65.05,67.98 68.94,67.98 73.15,63.77 73.15,52.94 75.42,50.67 v76.39,50.67 | ADS1.SDA 52.76,75.16 52.72,75.19 52.72,76.62 53.56,77.45 65.1,77.45 78.39,64.16 80.72,64.16 v80.71,64.18 | v80.71,64.18
  Bottom 0.406: X7.3 56.09,14.07 56.09,42.64 57.19,43.73 v57.23,43.73 58.96,45.47 MCP1.SDA/SI | 89.19,64.87 TTGO1.21 81.33,64.8 v80.71,64.18 78.32,61.79 78.32,51.32 77.67,50.67 v76.39,50.67
TX
  Bottom 0.406: TTL-RS1.TX 81.07,20.67 83.6,23.2 83.6,37.36 71.68,49.28 71.68,60.66 70.04,62.3 66.44,62.3 TTGO1.17
TX1
  Bottom 0.406: TTGO1.14 90.67,57.18 91.64,58.15 91.64,71.35 88.81,74.17 86.63,74.17 83.58,77.22 83.58,82.42 80.8,85.2 42,85.2 39.6,82.8 39.6,81.64 X4.2 40.47,80.77
VCC  (via drill 1)
  Top 0.406: R19.1 44.39,62.76 R20.1 48.29,62.71 R21.1 52.79,62.76 R17.1 60.74,62.76 R18.1 60.84,67.36 60.45,67.74 | 60.45,67.74 R26.1 62.38,67.74 v62.97,68.33 62.97,72.35 ADS1.VDD | 60.45,67.74 57.11,67.74 R25.1 57.01,67.74 R24.1 52.71,67.69 R23.1 48.11,67.64 R22.1 | v59.19,38.69 59.19,52.55 62.15,55.51 v62.19,55.47 | v62.19,55.47
  Bottom 0.406: TTL-RS1.VCC 71.13,23.65 70.57,24.21 66.45,24.21 TTGO1.5V@1 65.39,24.16 64.11,25.44 64.11,37.11 63.37,37.85 MCP1.RST 60.03,37.85 v59.19,38.69 | MCP1.VCC 62.19,53.15 v62.19,55.47 60.83,56.83 60.83,66.19 v62.97,68.33 64.38,69.73 64.38,77.28 63.28,78.37 X8.1